# Altium project STEPPER-Board-v1.0.PrjPcb (part 5 of 7)

## Sheet Stepper_Driver_Sheet1.SchDoc
size 420 x 297 mm; SheetNumber: 7; SheetTotal: 14
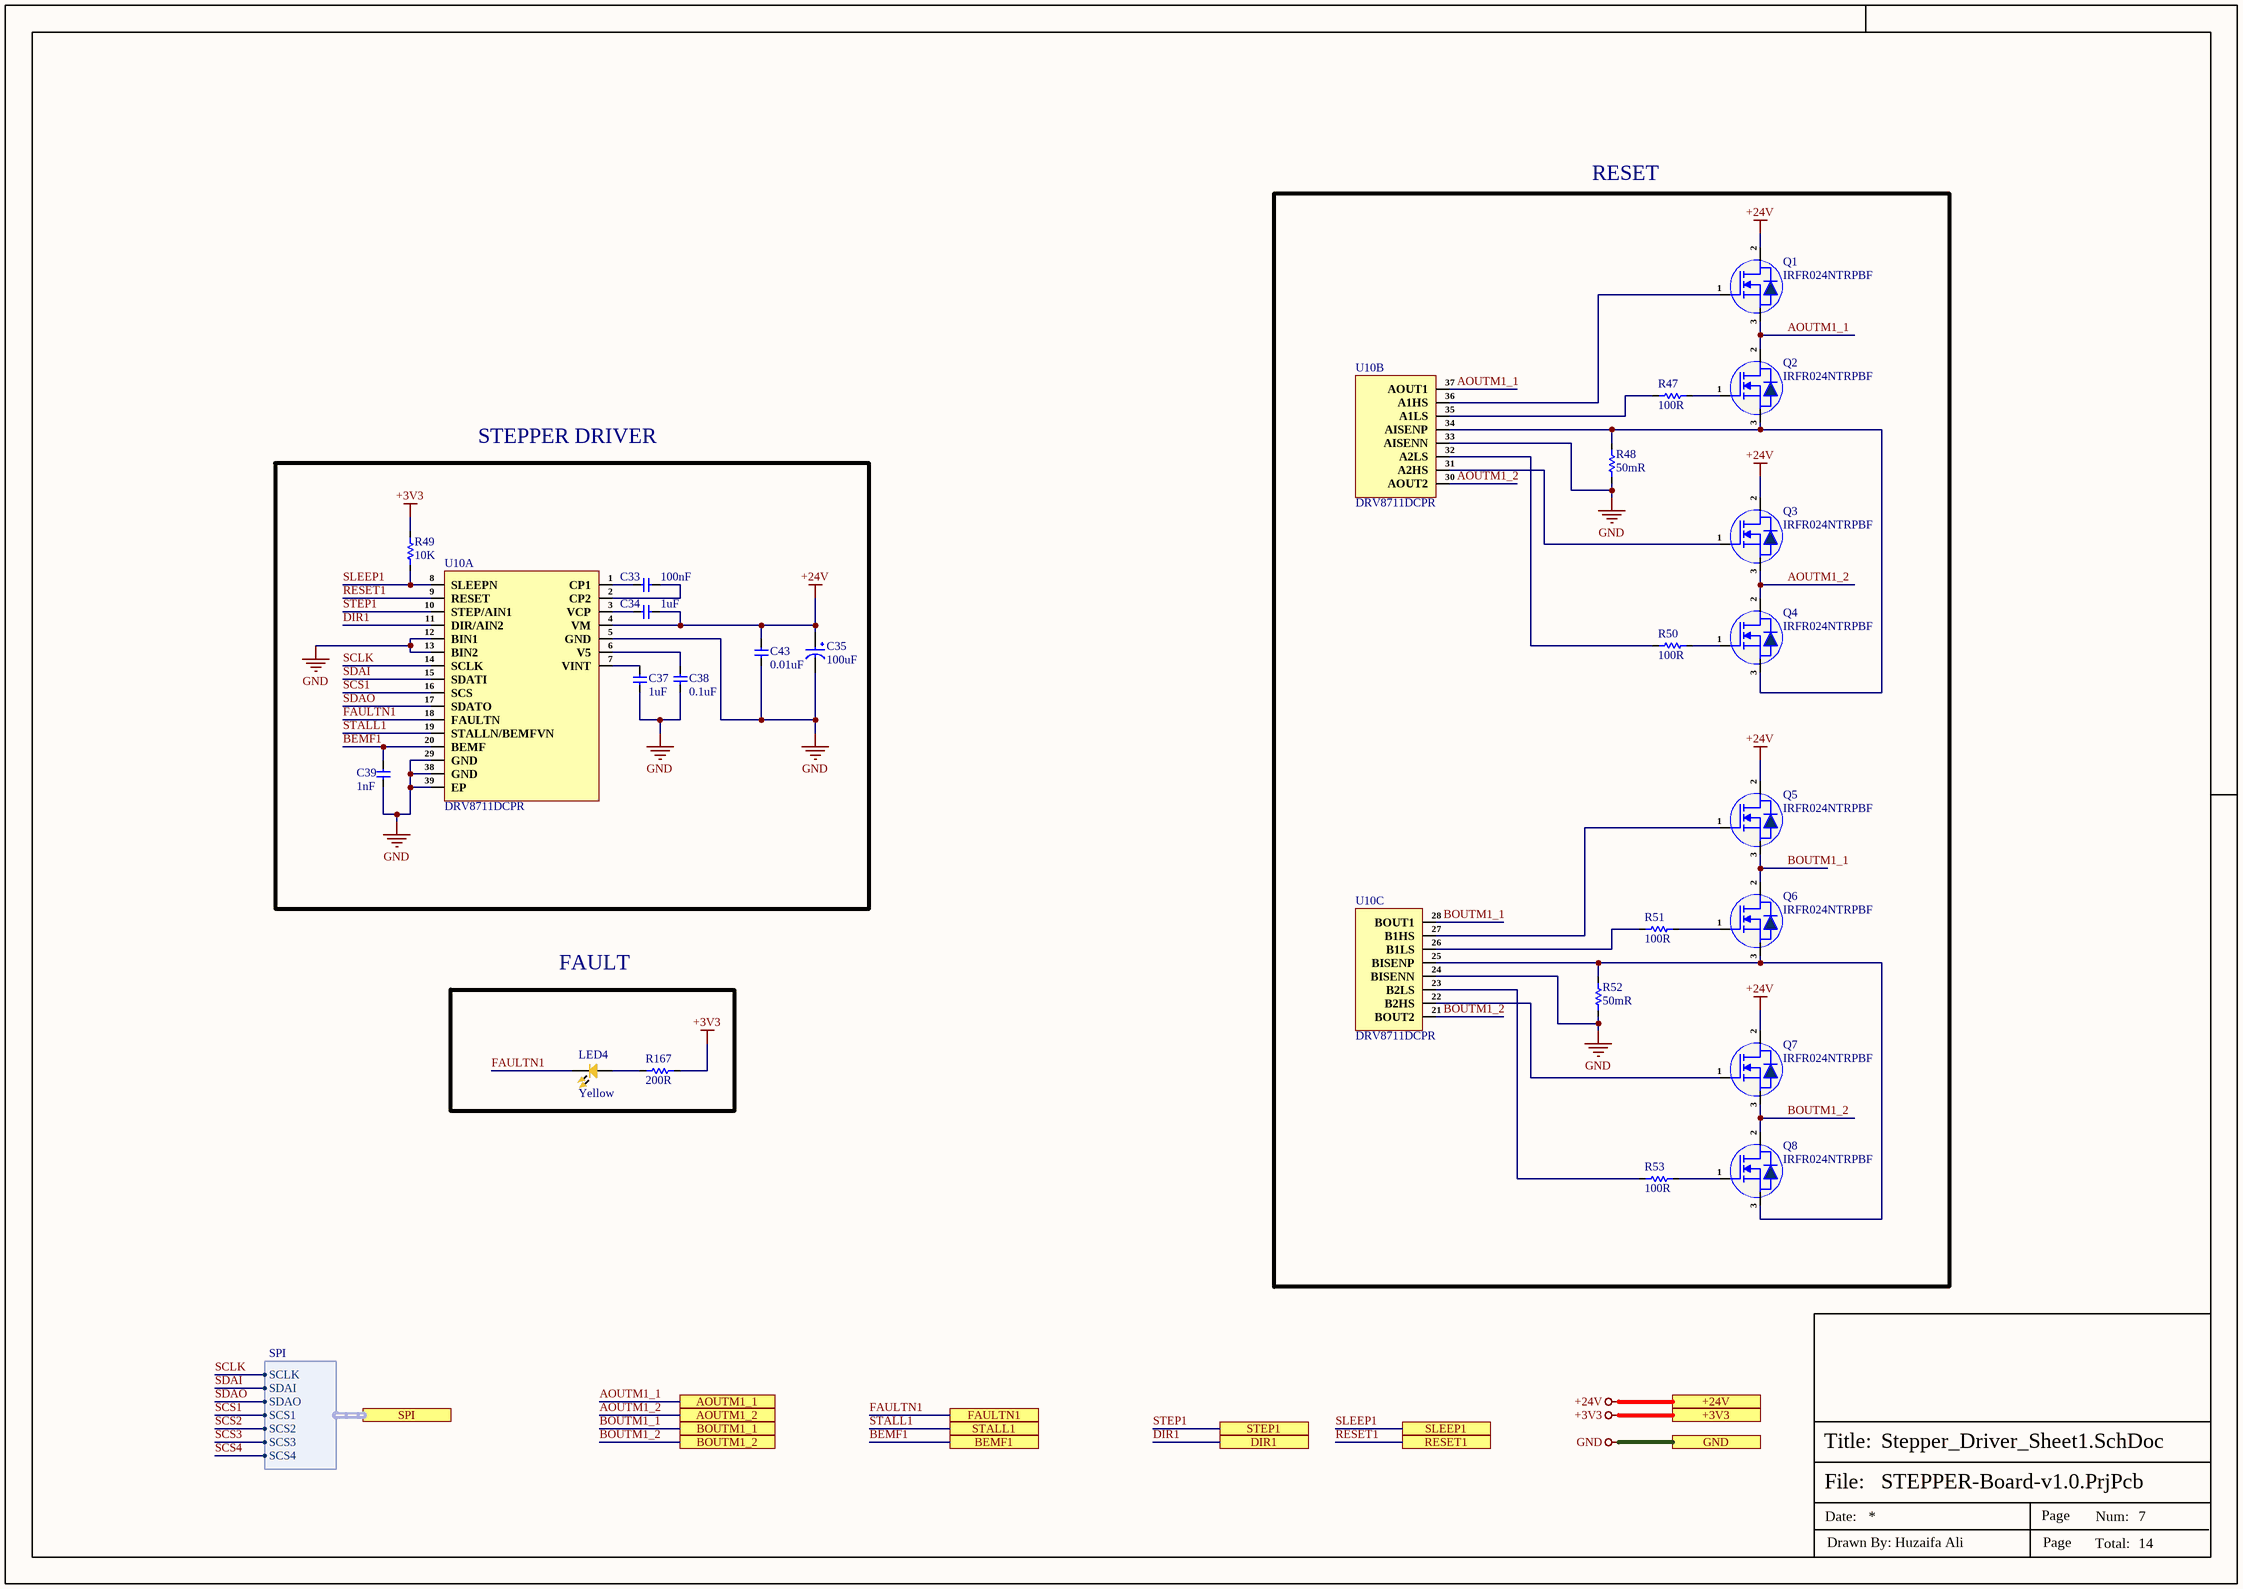
[diagram p9: Stepper_Driver_Sheet1.SchDoc]

### Parts
C33  100nF  [cap-0402]
C34  1uF  [Cap-0402]
C35  100uF  [UWT1H101MNL1GS_]
C37  1uF  [Cap-0402]
C38  0.1uF  [Cap-0402]
C39  1nF  [Cap-0402]
C43  0.01uF  [Cap-0603]
LED4  Yellow  [LED-0603]
Q1  IRFR024NTRPBF  [DPAK]
Q2  IRFR024NTRPBF  [DPAK]
Q3  IRFR024NTRPBF  [DPAK]
Q4  IRFR024NTRPBF  [DPAK]
Q5  IRFR024NTRPBF  [DPAK]
Q6  IRFR024NTRPBF  [DPAK]
Q7  IRFR024NTRPBF  [DPAK]
Q8  IRFR024NTRPBF  [DPAK]
R47  100R  [Res-0402]
R48  50mR  [RES-2010]
R49  10K  [Res-0402]
R50  100R  [Res-0402]
R51  100R  [Res-0402]
R52  50mR  [RES-2010]
R53  100R  [Res-0402]
R167  200R  [Res-0402]
U10  DRV8711DCPR  [HTSSOP-38-EP-4.4mm]  (parts A,B,C of 3)

### Blocks framed on the sheet
RESET: Q1-Q8 R47 R48 R50-R53 U10
STEPPER DRIVER: C33-C35 C37-C39 C43 R49 U10
FAULT: LED4 R167

### Ports
+3V3 (see Top_Sheet[4A], CAN_Sheet[5D], Controller_Sheet[5D], EtherCAT_Sheet[5D], GPIO_EXPANDER_Sheet[5D], Power_Sheet[5D], RJ45_Sheet[5D], RS485_RS232_Sheet[2D], Stepper_Driver_Sheet2[5D], Stepper_Driver_Sheet3[5D], Stepper_Driver_Sheet4[5D]), +24V (see Top_Sheet[4A], Connector_Sheet[5D], Power_Sheet[5D], Stepper_Driver_Sheet2[5D], Stepper_Driver_Sheet3[5D], Stepper_Driver_Sheet4[5D]), AOUTM1_1 (see Top_Sheet[5A], Connector_Sheet[1D]), AOUTM1_2 (see Top_Sheet[5A], Connector_Sheet[1D]), BEMF1 (see Top_Sheet[4A], Controller_Sheet[4D]), BOUTM1_1 (see Top_Sheet[5B], Connector_Sheet[1D]), BOUTM1_2 (see Top_Sheet[5B], Connector_Sheet[1D]), DIR1 (see Top_Sheet[4A], Controller_Sheet[4D]), FAULTN1 (see Top_Sheet[4A], GPIO_EXPANDER_Sheet[2D]), GND (see Top_Sheet[4A], CAN_Sheet[5D], Connector_Sheet[5D], Controller_Sheet[5D], DIO_Isolation_Sheet[5D], EtherCAT_Sheet[5D], GPIO_EXPANDER_Sheet[5D], Power_Sheet[5D], RJ45_Sheet[5D], RS485_RS232_Sheet[2D], Stepper_Driver_Sheet2[5D], Stepper_Driver_Sheet3[5D], Stepper_Driver_Sheet4[5D]), RESET1 (see Top_Sheet[4A], GPIO_EXPANDER_Sheet[3D]), SLEEP1 (see Top_Sheet[4B], GPIO_EXPANDER_Sheet[3D]), SPI (harness SPI, see Top_Sheet[5A], Controller_Sheet[1D], GPIO_EXPANDER_Sheet[1D], Stepper_Driver_Sheet2[1D], Stepper_Driver_Sheet3[1D], Stepper_Driver_Sheet4[1D]), STALL1 (see Top_Sheet[4A], GPIO_EXPANDER_Sheet[2D]), STEP1 (see Top_Sheet[4A], Controller_Sheet[4D])

### Harnesses
SPI: SCLK, SDAI, SDAO, SCS1, SCS2, SCS3, SCS4

### Nets
+3V3: R49.1 R167.2 ; port +3V3
+24V: C34.2 C35.1 C43.2 Q1.2(D) Q3.2(D) Q5.2(D) Q7.2(D) U10.4(VM) ; port +24V
GND: C35.2 C37.1 C38.2 C39.1 C43.1 R48.1 R52.1 U10.5(GND) U10.12(BIN1) U10.13(BIN2) U10.24(BISENN) U10.29(GND) U10.33(AISENN) U10.38(GND) U10.39(EP) ; port GND
AOUTM1_1: Q1.3(S) Q2.2(D) U10.37(AOUT1) ; port AOUTM1_1
AOUTM1_2: Q3.3(S) Q4.2(D) U10.30(AOUT2) ; port AOUTM1_2
BEMF1: C39.2 U10.20(BEMF) ; port BEMF1
BOUTM1_1: Q5.3(S) Q6.2(D) U10.28(BOUT1) ; port BOUTM1_1
BOUTM1_2: Q7.3(S) Q8.2(D) U10.21(BOUT2) ; port BOUTM1_2
DIR1: U10.11(DIR/AIN2) ; port DIR1
FAULTN1: LED4.2 U10.18(FAULTN) ; port FAULTN1
RESET1: U10.9(RESET) ; port RESET1
SCLK: U10.14(SCLK) ; port SPI.SCLK
SCS1: U10.16(SCS) ; port SPI.SCS1
SDAI: U10.15(SDATI) ; port SPI.SDAI
SDAO: U10.17(SDATO) ; port SPI.SDAO
SLEEP1: R49.2 U10.8(SLEEPN) ; port SLEEP1
STALL1: U10.19(STALLN/BEMFVN) ; port STALL1
STEP1: U10.10(STEP/AIN1) ; port STEP1
NetC33_1: C33.1 U10.1(CP1)
NetC33_2: C33.2 U10.2(CP2)
NetC34_1: C34.1 U10.3(VCP)
NetC37_2: C37.2 U10.7(VINT)
NetC38_1: C38.1 U10.6(V5)
NetLED4_1: LED4.1 R167.1
NetQ1_1: Q1.1(G) U10.36(A1HS)
NetQ2_1: Q2.1(G) R47.2
NetQ2_3: Q2.3(S) Q4.3(S) R48.2 U10.34(AISENP)
NetQ3_1: Q3.1(G) U10.31(A2HS)
NetQ4_1: Q4.1(G) R50.2
NetQ5_1: Q5.1(G) U10.27(B1HS)
NetQ6_1: Q6.1(G) R51.2
NetQ6_3: Q6.3(S) Q8.3(S) R52.2 U10.25(BISENP)
NetQ7_1: Q7.1(G) U10.22(B2HS)
NetQ8_1: Q8.1(G) R53.2
NetR47_1: R47.1 U10.35(A1LS)
NetR50_1: R50.1 U10.32(A2LS)
NetR51_1: R51.1 U10.26(B1LS)
NetR53_1: R53.1 U10.23(B2LS)

### Notes on the sheet
- File:
- Title:
- Date:
- Page
- Num:
- Total:
- Drawn By: Huzaifa Ali

### Library data of the parts
C33 = C1005X7R1H104KT000F: CAP CER 0.1UF 50V X7R 0402; Manufacturer: TDK; Tolerance: 10%; Voltage: 25V; Item Type: Capacitor; Supplier 1: Avnet; Manufacturer Part Number: C1005X7R1H104KT000F; RoHS: No; Category: Ceramic Capacitors; Dielectric: X7R; Supplier Part Number 1: C1005X7R1H104KT000F; LCSC Part Number: C361198; ComponentLink1Description: LCSC; ComponentLink1URL: https://www.lcsc.com/product-detail/Multilayer-Ceramic-Capacitors-MLCC-SMD-SMT_TDK-C1005X7R1H104KT000F_C361198.html
C34 C37 = CC0402KRX5R6BB105: CAP CER 1UF 10V X5R 0402; Manufacturer: Yageo; Tolerance: 10%; Dissipation Factor: 15%; Item Type: Capacitor; Supplier 1: Mouser; Manufacturer Part Number: CC0402KRX5R6BB105; RoHS: Yes; Category: Ceramic Capacitors; Stock 1: 6711367; Pricing 1: 1=0.11000, 10=0.05500, 50=0.05500, 100=0.03300, 500=0.02700, 1000=0.02200, 2500=0.02100, 10000=0.01800 (USD); Mount: Surface Mount; Case/Package: 0402; Number of Pins: 2; Case Code (Metric): 1005; Case Code (Imperial): 0402; Min Operating Temperature: -55°C; Max Operating Temperature: 85°C; Capacitance: 1uF; Dielectric: X5R; Package Quantity: 1; Voltage Rating: 10V; Packaging: Tape and Reel; Voltage Rating (DC): 10V; Termination: SMD/SMT; Resistor Type: Ceramic; Series: CC; Construction: Flat; Length: 1mm; Width: 0.02inch; Height: 0.5mm; Thickness: 0.022inch; Depth: 0.5mm; Radiation Hardening: No; REACH SVHC: No SVHC; Lead Free: Lead Free; Halogen Free: Halogen Free; RoHS Compliant: Yes; ComponentLink1URL: https://datasheet.ciiva.com/176/upy-gphc-x5r-4v-to-50v-12-176704.pdf?src-supplier=Digi-Key; ComponentLink1Description: https://datasheet.ciiva.com/176/upy-gphc-x5r-4v-to-50v-12-176704.pdf?src-supplier=Digi-Key; ComponentLink2URL: https://datasheet.ciiva.com/176/mlccorderingcode-176705.pdf?src-supplier=Digi-Key; ComponentLink2Description: https://datasheet.ciiva.com/176/mlccorderingcode-176705.pdf?src-supplier=Digi-Key; ComponentLink3URL: https://datasheet.ciiva.com/176/mlccorderingcode-176706.pdf?src-supplier=Digi-Key; ComponentLink3Description: https://datasheet.ciiva.com/176/mlccorderingcode-176706.pdf?src-supplier=Digi-Key; Supplier Part Number 1: 603-CC402KRX5R6BB105; LCSC Part Number: C106254
C35 = UWT1H101MNL1GS: CAP ALUM 100UF 20% 50V SMD; Manufacturer: Nichicon; Dielectric Material: Aluminium; Ripple Current: 140mA; Leakage Current: 3uA; Life (Hours): 1000Hour; Dissipation Factor: 0.14%; Item Type: Capacitor; Supplier 1: Digi-Key; Manufacturer Part Number: UWT1H101MNL1GS; Stock 1: 24169; Pricing 1: 1=0.57, 10=0.405, 50=0.3058, 100=0.2664 (USD); Mount: Surface Mount; Case/Package: Radial; Number of Pins: 2; Min Operating Temperature: -55°C; Max Operating Temperature: 105°C; Capacitance: 100uF; Tolerance: 20%; Package Quantity: 500; Voltage Rating: 50V; Packaging: Tape and Reel; Ripple Current (AC): 140mA; Voltage Rating (DC): 50V; Termination: SMD/SMT; Voltage: 50V; Series: WT; Construction: Cylindrical; Diameter: 8mm; Length: 10mm; Height: 10mm; Height - Seated (Max): 0.413inch; Radiation Hardening: No; REACH SVHC: No SVHC; Lead Free: Lead Free; RoHS Compliant: Yes; ComponentLink1URL: http://www.farnell.com/datasheets/2100058.pdf?src-supplier=Element14; ComponentLink1Description: http://www.farnell.com/datasheets/2100058.pdf?src-supplier=Element14; ComponentLink2URL: http://www.farnell.com/datasheets/2576809.pdf?src-supplier=Element14; ComponentLink2Description: http://www.farnell.com/datasheets/2576809.pdf?src-supplier=Element14; ComponentLink3URL: http://www.nichicon.co.jp/english/products/pdfs/e-ch_ref.pdf?src-supplier=Digi-Key; ComponentLink3Description: http://www.nichicon.co.jp/english/products/pdfs/e-ch_ref.pdf?src-supplier=Digi-Key; ComponentLink4URL: http://www.mouser.com/ds/2/293/e-wt-30307.pdf?src-supplier=Mouser; ComponentLink4Description: http://www.mouser.com/ds/2/293/e-wt-30307.pdf?src-supplier=Mouser; ComponentLink5URL: http://uk.rs-online.com/webdocs/13ec/0900766b813ecfdc.pdf?src-supplier=RSComponents; ComponentLink5Description: http://uk.rs-online.com/webdocs/13ec/0900766b813ecfdc.pdf?src-supplier=RSComponents; ComponentLink6URL: http://www.nichicon.co.jp/english/products/pdfs/e-wt.pdf?src-supplier=Avnet; ComponentLink6Description: http://www.nichicon.co.jp/english/products/pdfs/e-wt.pdf?src-supplier=Avnet; ComponentLink7URL: http://products.nichicon.co.jp/en/pdf/XJA043/e-wt.pdf?src-supplier=Future+Electronics; ComponentLink7Description: http://products.nichicon.co.jp/en/pdf/XJA043/e-wt.pdf?src-supplier=Future+Electronics; ComponentLink8URL: http://www.nichicon.co.jp/english/products/pdfs/e-wt.pdf?src-supplier=Avnet+Europe; ComponentLink8Description: http://www.nichicon.co.jp/english/products/pdfs/e-wt.pdf?src-supplier=Avnet+Europe; Supplier Part Number 1: 493-2226-1-ND; LCSC Part Number: C445063
C38 = CC0402JRX7R7BB104: CAP CER 0.1UF 16V X7R 0402; Manufacturer: Yageo; Material: 4241ConductorMaterial; Value: 100nF; Tolerance: 5%; Item Type: Capacitor; Supplier: Digikey; Supplier Part Number: 311-1676-1-ND; Manufacturer Part Number: CC0402JRX7R7BB104; RoHS: Yes; Category: Ceramic Capacitors; Stock: 1659111; Pricing: 1=0.1, 10=0.046, 50=0.0262, 100=0.0203, 500=0.01528, 1000=0.012, 2500=0.01091, 5000=0.01004 (USD); Mounting Technology: Surface Mount; Case/Package: 0402; Case Code (Metric): 1005; Case Code (Imperial): 0402; Min Operating Temperature: -55°C; Max Operating Temperature: 125°C; Dielectric: X7R; Packaging: Tape and Reel; Package Quantity: 10000; Voltage Rating (DC): 16V; Voltage Rating: 16V; Series: CC; Construction: Flat; Length: 0.039inch; Width: 0.02inch; Height: 0.5mm; Thickness: 0.022inch; Lead Free: Lead Free; Halogen Free: Halogen Free; RoHS Compliant: Yes; ComponentLink1URL: https://datasheet.ciiva.com/13210/upy-gphc-x7r-6-3v-to-50v-8-12304-13210152.pdf?src-supplier=Mouser; ComponentLink1Description: https://datasheet.ciiva.com/13210/upy-gphc-x7r-6-3v-to-50v-8-12304-13210152.pdf?src-supplier=Mouser; LCSC Part Number: C541464
C39 = C1005C0G1E102JT000F: CAP CER 1000PF 25V C0G 0402; Manufacturer: TDK; Item Type: Capacitor; ComponentLink1Description: LCSC; ComponentLink1URL: https://www.lcsc.com/product-detail/Multilayer-Ceramic-Capacitors-MLCC-SMD-SMT_TDK-C1005C0G1E102JT000F_C343059.html; Manufacturer Part Number: C1005C0G1E102JT000F; Package: 0402; LCSC Part Number: C343059
C43 = GRM1885C1H103JA01D: CAP CER 10000PF 50V C0G/NP0 0603; Manufacturer: Murata; Material: Ceramic; Capacitance: 10nF; Tolerance: 5%; Dielectric: C0G; Supplier 1: RSComponents; Manufacturer Part Number: GRM1885C1H103JA01D; RoHS: Yes; Category: Ceramic Capacitors; Stock 1: 80000; Pricing 1: 4000=0.03500, 8000=0.03200 (GBP); Mount: Surface Mount; Case/Package: 0603; Case Code (Metric): 1608; Case Code (Imperial): 0603; Min Operating Temperature: -55°C; Max Operating Temperature: 125°C; Packaging: Tape and Reel; Package Quantity: 4000; Voltage Rating: 50V; Voltage Rating (DC): 50V; Termination: SMD/SMT; Voltage: 50V; Series: GRM; Length: 1.6mm; Width: 0.8mm; Height: 0.8mm; Thickness: 0.035inch; Lead Pitch: 0.5mm; Depth: 0.8mm; REACH SVHC: No SVHC; Lead Free: Lead Free; RoHS Compliant: Yes; ComponentLink1URL: https://datasheet.ciiva.com/41860/partnumbering-e-01-41860759.pdf?src-supplier=Digi-Key; ComponentLink1Description: https://datasheet.ciiva.com/41860/partnumbering-e-01-41860759.pdf?src-supplier=Digi-Key; ComponentLink2URL: https://datasheet.ciiva.com/29537/partnumbering-e-01-29537910.pdf?src-supplier=Digi-Key; ComponentLink2Description: https://datasheet.ciiva.com/29537/partnumbering-e-01-29537910.pdf?src-supplier=Digi-Key; Supplier Part Number 1: 1449032
LED4 = NCD0603Y2: yellow 0603 Light Emitting Diodes (LED) ROHS; Manufacturer: Foshan NationStar Optoelectronics; Manufacturer Part Number: NCD0603Y2; Package: 0603; LCSC Part Number: C89811; Item Type: LED; ComponentLink1Description: LCSC; ComponentLink1URL: https://www.lcsc.com/product-detail/Light-Emitting-Diodes-LED_Foshan-NationStar-Optoelectronics-NCD0603Y2_C89811.html
Q1-Q8 = IRFR024NTRPBF: MOSFET N-CH 55V 17A DPAK; Manufacturer: Infineon; Nominal Vgs: 4V; Number of Elements: 1NUMBER; Fall Time: 27ns; Element Configuration: 5460ElementConfiguration; On-State Resistance: 75mR; Value: 75mR; Supplier: Mouser; Supplier Part Number: 942-IRFR024NTRPBF; Manufacturer Part Number: IRFR024NTRPBF; RoHS: Yes; Item Type: MOSFET; Stock: 51400; Pricing: 1=0.62, 10=0.541, 50=0.541, 100=0.375, 1000=0.294, 10000=0.293 (USD); Current Rating: 17A; Voltage Rating (DC): 55V; Package Quantity: 2000NUMBER; Radiation Hardening: 5898YesNo
R47 R50 R51 R53 = RC0402FR-07100RL: RES 100 OHM 1% 1/16W 0402; Manufacturer: Yageo; Power Rating: 62.5mW; Voltage Rating: 50V; Temperature Coefficient: 100ppm/°C; Max Power Dissipation: 63mW; Item Type: Resistor; Supplier 1: Mouser; Manufacturer Part Number: RC0402FR-07100RL; RoHS: Yes; Category: Chip SMD Resistors; Stock 1: 699545; Pricing 1: 1=0.10000, 10=0.01200, 50=0.01200, 100=0.00500, 1000=0.00300, 2500=0.00200, 10000=0.00100 (USD); Case/Package: 0402; Number of Pins: 2; Case Code (Imperial): 0402; Case Code (Metric): 1005; Size Code: 0402; Min Operating Temperature: -55°C; Max Operating Temperature: 155°C; Tolerance: 1%; Voltage Rating (DC): 50V; Resistance: 100R; Packaging: Tape and Reel; Termination: SMD/SMT; Resistor Type: Thick Film; Features: Moisture Resistant; Series: RC; Number of Terminations: 2; Resistance Tolerance: 1%; Construction: Rectangular; Technology: THICK FILM; Length: 1mm; Width: 0.5mm; Height: 0.32mm; Depth: 0.5mm; RoHS Compliant: Yes; REACH SVHC: No SVHC; Military Standard: Not; Lead Free: Lead Free; ComponentLink1URL: https://datasheet.ciiva.com/11808/0900766b80c66297-11808765.pdf?src-supplier=RSComponents; ComponentLink1Description: https://datasheet.ciiva.com/11808/0900766b80c66297-11808765.pdf?src-supplier=RSComponents; ComponentLink2URL: https://datasheet.ciiva.com/7849/1784430-7849810.pdf?src-supplier=Element14; ComponentLink2Description: https://datasheet.ciiva.com/7849/1784430-7849810.pdf?src-supplier=Element14; ComponentLink3URL: https://datasheet.ciiva.com/28367/1018594-28367226.pdf?src-supplier=Element14; ComponentLink3Description: https://datasheet.ciiva.com/28367/1018594-28367226.pdf?src-supplier=Element14; ComponentLink4URL: https://datasheet.ciiva.com/22747/1018594-22747511.pdf?src-supplier=Element14; ComponentLink4Description: https://datasheet.ciiva.com/22747/1018594-22747511.pdf?src-supplier=Element14; ComponentLink5URL: https://datasheet.ciiva.com/12667/pyu-rc0402-51-rohs-l-6-r-12667957.pdf?src-supplier=Mouser; ComponentLink5Description: https://datasheet.ciiva.com/12667/pyu-rc0402-51-rohs-l-6-r-12667957.pdf?src-supplier=Mouser; ComponentLink6URL: https://datasheet.ciiva.com/15189/getdatasheetpartid-329466-15189335.pdf?src-supplier=Verical; ComponentLink6Description: https://datasheet.ciiva.com/15189/getdatasheetpartid-329466-15189335.pdf?src-supplier=Verical; ComponentLink7URL: https://datasheet.ciiva.com/16740/pyu-rc0402-51-rohs-l-6-r-16740566.pdf?src-supplier=Future+Electronics; ComponentLink7Description: https://datasheet.ciiva.com/16740/pyu-rc0402-51-rohs-l-6-r-16740566.pdf?src-supplier=Future+Electronics; Supplier Part Number 1: 603-RC0402FR-07100RL; LCSC Part Number: C106232
R48 R52 = RLM20FECR050: 1W 50mΩ Surface Mount Current Sensing Resistors ±50ppm/℃ ±1% 2010 Current Sense Resistors/Shunt Resistors ROHS; Manufacturer: TA-I Tech; Manufacturer Part Number: RLM20FECR050; Package: 2010; LCSC Part Number: C912938; Item Type: Shunt Resistor; ComponentLink1Description: LCSC; ComponentLink1URL: https://www.lcsc.com/product-detail/Current-Sense-Resistors-Shunt-Resistors_TA-I-Tech-RLM20FECR050_C912938.html
R49 = RC0402FR-0710KL: RES 10K OHM 1% 1/16W 0402; Manufacturer: Yageo; Resistance: 10kR; Voltage Rating (DC): 50V; Temperature Coefficient: 100ppm/°C; Power Rating: 62.5mW; Max Power Dissipation: 63mW; Item Type: Resistor; Supplier 1: Mouser; Manufacturer Part Number: RC0402FR-0710KL; RoHS: Yes; Category: Chip SMD Resistors; Stock 1: 18648329; Pricing 1: 1=0.10000, 10=0.01400, 50=0.01400, 100=0.00500, 1000=0.00300, 10000=0.00200 (USD); Case/Package: 0402; Number of Pins: 2; Case Code (Imperial): 0402; Case Code (Metric): 1005; Min Operating Temperature: -55°C; Max Operating Temperature: 155°C; Resistor Type: Thick Film; Tolerance: 1%; Packaging: Tape and Reel; Voltage Rating: 50V; Termination: SMD/SMT; Working Voltage: 50V; Number of Terminations: 2; Features: Moisture Resistant; Series: RC; Resistance Tolerance: 1%; Construction: Rectangular; Length: 1mm; Width: 0.5mm; Height: 0.32mm; Depth: 0.5mm; Lead Pitch: 0.2mm; REACH SVHC: No SVHC; Lead Free: Lead Free; RoHS Compliant: Yes; Military Standard: Not; ComponentLink1URL: https://datasheet.ciiva.com/7660/38568-7660787.pdf?src-supplier=Element14; ComponentLink1Description: https://datasheet.ciiva.com/7660/38568-7660787.pdf?src-supplier=Element14; ComponentLink2URL: https://datasheet.ciiva.com/7849/1686128-7849814.pdf?src-supplier=Element14; ComponentLink2Description: https://datasheet.ciiva.com/7849/1686128-7849814.pdf?src-supplier=Element14; ComponentLink3URL: https://datasheet.ciiva.com/7983/1018594-7983486.pdf?src-supplier=Element14; ComponentLink3Description: https://datasheet.ciiva.com/7983/1018594-7983486.pdf?src-supplier=Element14; ComponentLink4URL: https://datasheet.ciiva.com/22747/1018594-22747512.pdf?src-supplier=Element14; ComponentLink4Description: https://datasheet.ciiva.com/22747/1018594-22747512.pdf?src-supplier=Element14; ComponentLink5URL: https://datasheet.ciiva.com/12667/pyu-rc0402-51-rohs-l-6-r-12667067.pdf?src-supplier=Mouser; ComponentLink5Description: https://datasheet.ciiva.com/12667/pyu-rc0402-51-rohs-l-6-r-12667067.pdf?src-supplier=Mouser; ComponentLink6URL: https://datasheet.ciiva.com/7849/1784430-7849813.pdf?src-supplier=Element14; ComponentLink6Description: https://datasheet.ciiva.com/7849/1784430-7849813.pdf?src-supplier=Element14; ComponentLink7URL: https://datasheet.ciiva.com/7849/1784430-7849815.pdf?src-supplier=Element14; ComponentLink7Description: https://datasheet.ciiva.com/7849/1784430-7849815.pdf?src-supplier=Element14; Supplier Part Number 1: 603-RC0402FR-0710KL; LCSC Part Number: C60490
R167 = RC0402FR-07200RL: RES 200 OHM 1% 1/16W 0402; Manufacturer: Yageo; Temperature Coefficient: 100ppm/°C; Power Rating: 63mW; Voltage Rating (DC): 50V; Supplier 1: Digi-Key; Manufacturer Part Number: RC0402FR-07200RL; RoHS: Yes; Category: Chip SMD Resistors; Stock 1: 19778; Pricing 1: 1=0.10000, 10=0.01600, 100=0.00660, 1000=0.00299, 2500=0.00259, 5000=0.00214 (USD); Case/Package: 0402; Case Code (Metric): 1005; Case Code (Imperial): 0402; Size Code: 0402; Min Operating Temperature: -55°C; Max Operating Temperature: 155°C; Tolerance: 1%; Resistance: 200R; Resistor Type: Thick Film; Packaging: Tape and Reel; Voltage Rating: 50V; Package Quantity: 1; Number of Terminations: 2; Termination: SMD/SMT; Max Power Dissipation: 63mW; Features: Moisture Resistant; Series: RC; Construction: Rectangular; Resistance Tolerance: 1%; Length: 1mm; Width: 0.02inch; Height: 0.016inch; Depth: 0.5mm; REACH SVHC: No SVHC; Lead Free: Lead Free; RoHS Compliant: Yes; Military Standard: Not; ComponentLink1URL: https://datasheet.ciiva.com/2553/pyu-r-int-thick-7-2553232.pdf?src-supplier=Digi-Key; ComponentLink1Description: https://datasheet.ciiva.com/2553/pyu-r-int-thick-7-2553232.pdf?src-supplier=Digi-Key; ComponentLink2URL: https://datasheet.ciiva.com/7983/1018594-7983509.pdf?src-supplier=Element14; ComponentLink2Description: https://datasheet.ciiva.com/7983/1018594-7983509.pdf?src-supplier=Element14; ComponentLink3URL: https://datasheet.ciiva.com/16804/pyu-rc0402-51-rohs-l-6-r-16804406.pdf?src-supplier=Future+Electronics; ComponentLink3Description: https://datasheet.ciiva.com/16804/pyu-rc0402-51-rohs-l-6-r-16804406.pdf?src-supplier=Future+Electronics; ComponentLink4URL: https://datasheet.ciiva.com/15189/getdatasheetpartid-331152-15189383.pdf?src-supplier=Verical; ComponentLink4Description: https://datasheet.ciiva.com/15189/getdatasheetpartid-331152-15189383.pdf?src-supplier=Verical; ComponentLink5URL: https://datasheet.ciiva.com/7849/1018594-7849898.pdf?src-supplier=Element14; ComponentLink5Description: https://datasheet.ciiva.com/7849/1018594-7849898.pdf?src-supplier=Element14; ComponentLink6URL: https://datasheet.ciiva.com/5562/pyu-rc0402-51-rohs-l-6-r-8721-5562539.pdf?src-supplier=Mouser; ComponentLink6Description: https://datasheet.ciiva.com/5562/pyu-rc0402-51-rohs-l-6-r-8721-5562539.pdf?src-supplier=Mouser; ComponentLink7URL: https://datasheet.ciiva.com/7849/1018594-7849899.pdf?src-supplier=Element14; ComponentLink7Description: https://datasheet.ciiva.com/7849/1018594-7849899.pdf?src-supplier=Element14; ComponentLink8URL: https://datasheet.ciiva.com/2553/pyu-r-int-thick-7-2553230.pdf?src-supplier=Digi-Key; ComponentLink8Description: https://datasheet.ciiva.com/2553/pyu-r-int-thick-7-2553230.pdf?src-supplier=Digi-Key; ComponentLink9URL: https://datasheet.ciiva.com/2553/pyu-r-int-thick-7-2553231.pdf?src-supplier=Digi-Key; ComponentLink9Description: https://datasheet.ciiva.com/2553/pyu-r-int-thick-7-2553231.pdf?src-supplier=Digi-Key; Supplier Part Number 1: 311-200LRCT-ND; LCSC Part Number: C114764
U10 = DRV8711DCPR: IC MTR DRV BIPOLR 8-52V 38HTSSOP; Manufacturer: Texas Instruments; Output Current: 200mA; Output Voltage: 5V; Min Supply Voltage: 8V; Max Supply Voltage: 52V; Interface: SPI; Supply Current: 17mA; Supplier: Mouser; LCSC Part Number: C60013; Manufacturer Part Number: DRV8711DCPR; RoHS: Yes; Item Type: IC; Stock: 9050; Pricing: 1=4.97, 10=4.29, 50=4.29, 100=3.66, 1000=2.63, 10000=2.48 (USD); Mounting Technology: Surface Mount; Case/Package: HTSSOP; Pins: 38; Min Operating Temperature: -40°C; Max Operating Temperature: 85°C; Packaging: Tape and Reel; Package Quantity: 2000; Series: -; Radiation Hardening: No; Lead Free: Lead Free; RoHS Compliant: Yes; ComponentLink1URL: https://datasheet.ciiva.com/24016/slvsc40d-317294-24016712.pdf?src-supplier=Mouser; ComponentLink1Description: https://datasheet.ciiva.com/24016/slvsc40d-317294-24016712.pdf?src-supplier=Mouser

## Sheet Stepper_Driver_Sheet2.SchDoc
size 420 x 297 mm; SheetNumber: 8; SheetTotal: 14
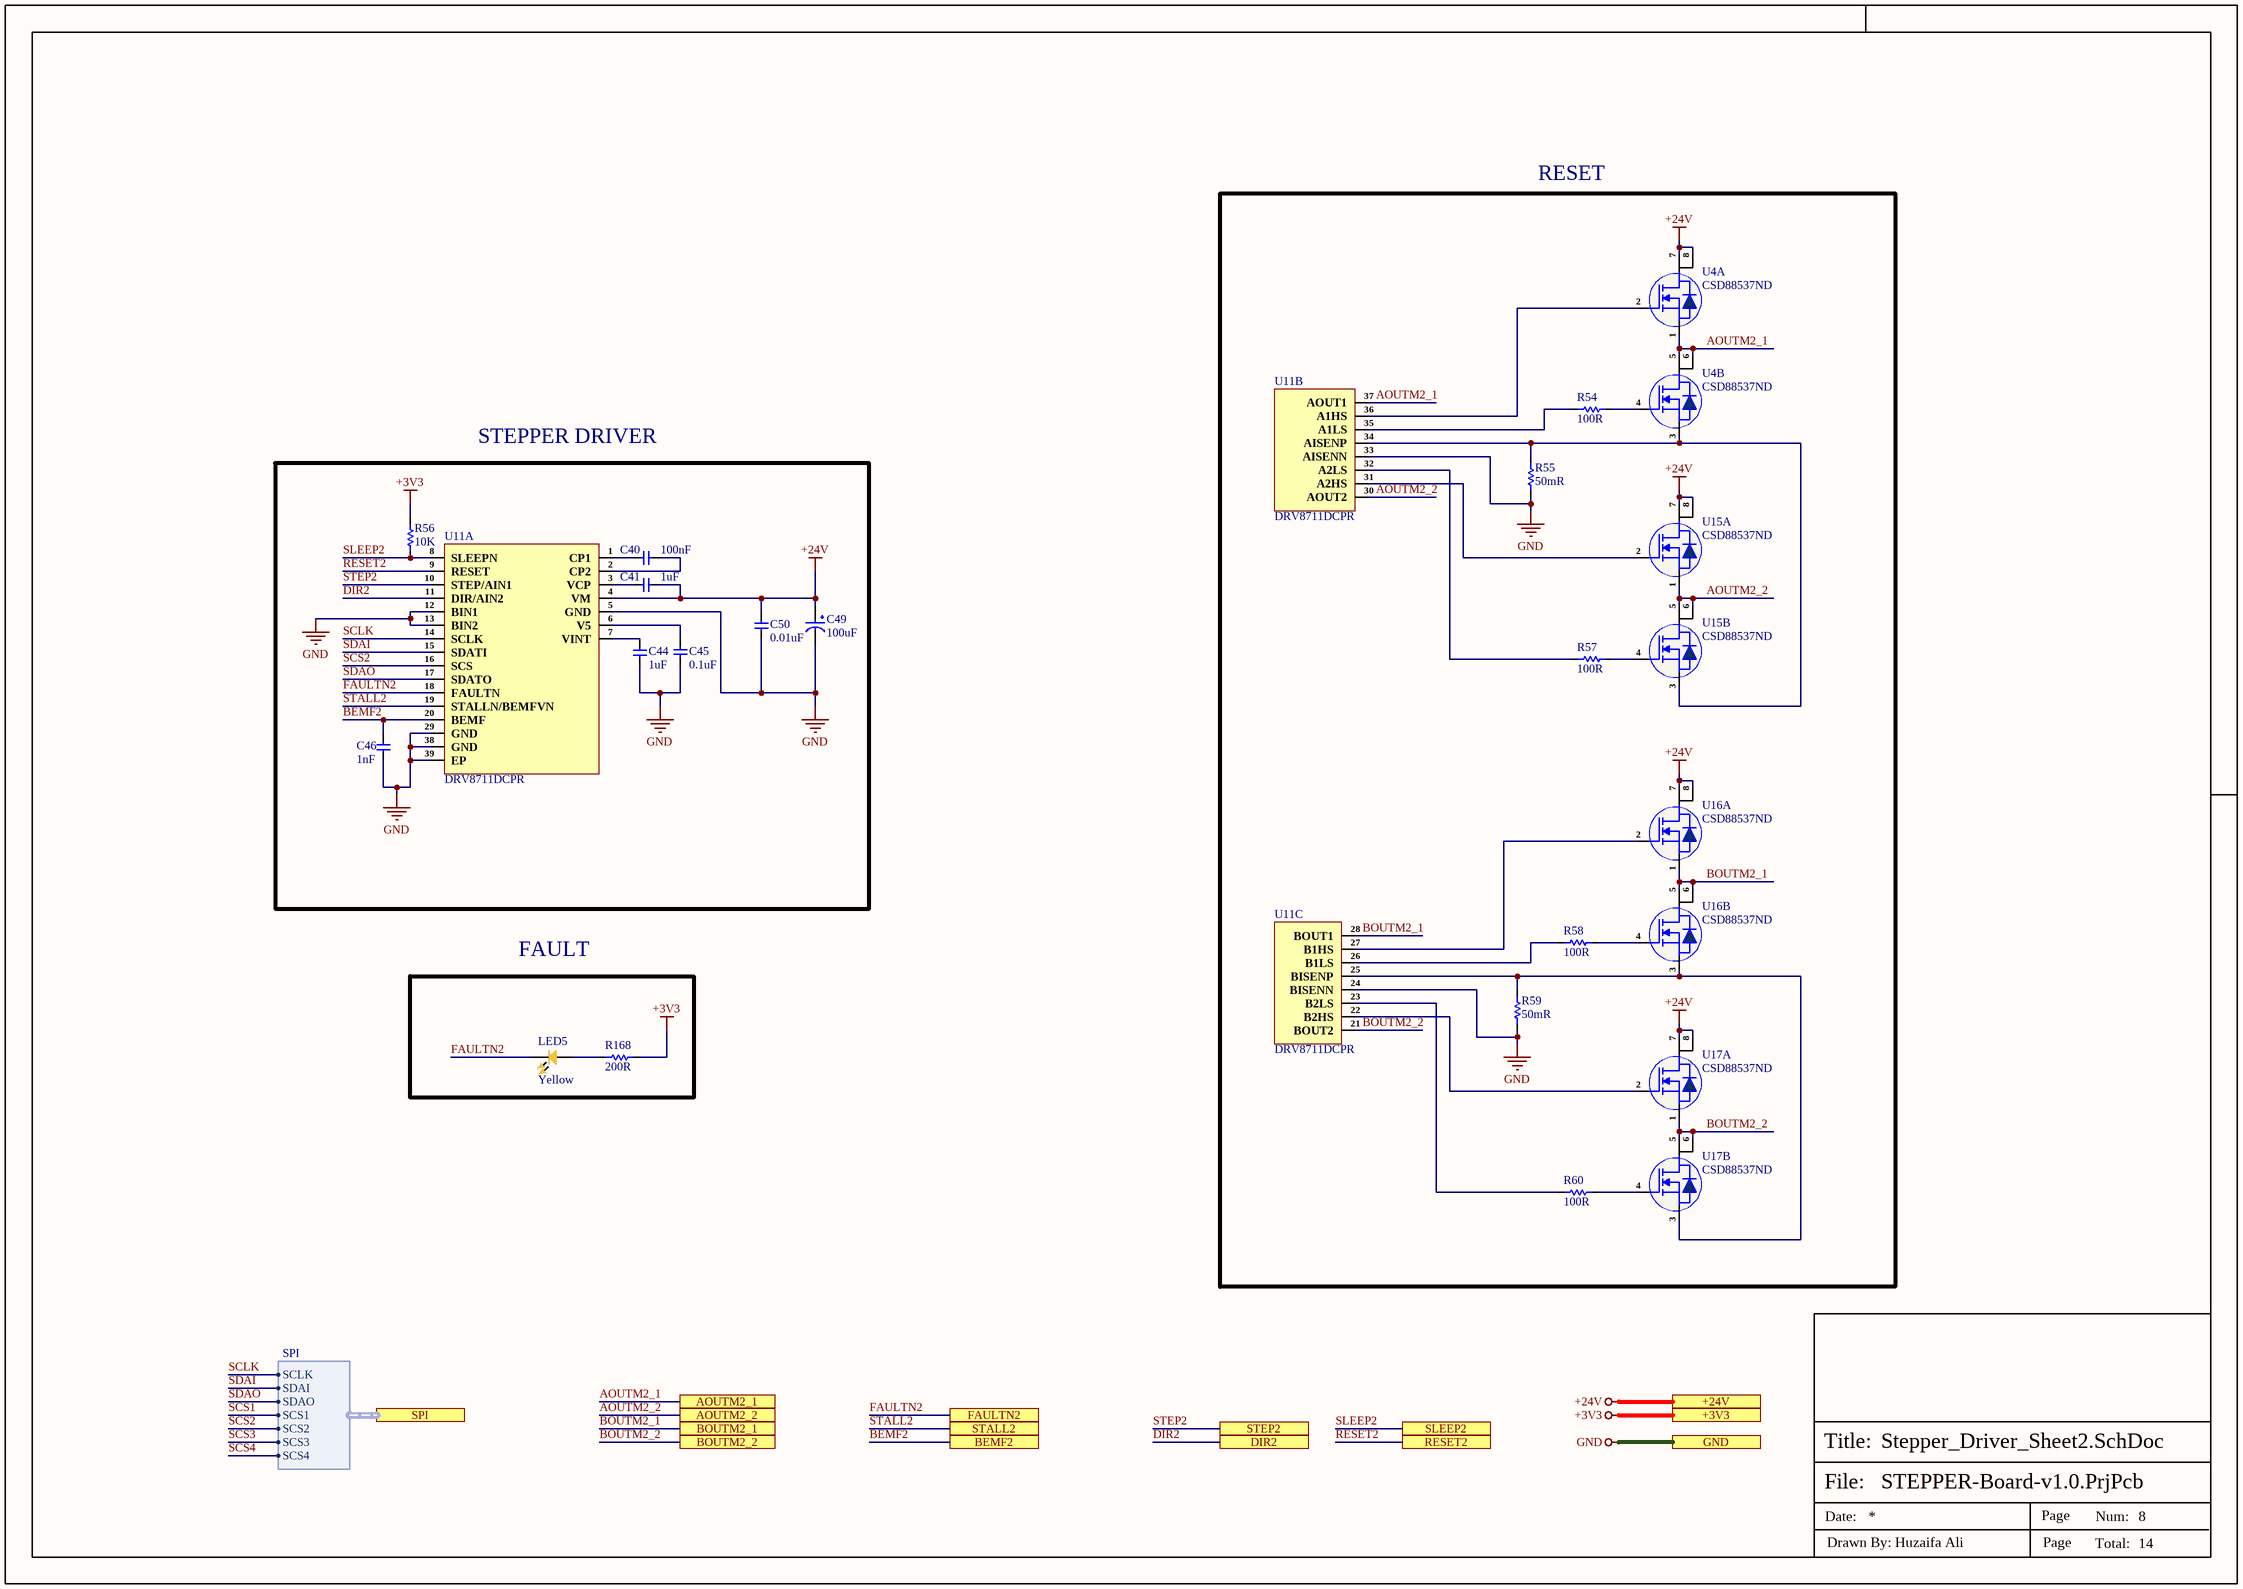
[diagram p10: Stepper_Driver_Sheet2.SchDoc]

### Parts
C40  100nF  [cap-0402]
C41  1uF  [Cap-0402]
C44  1uF  [Cap-0402]
C45  0.1uF  [Cap-0402]
C46  1nF  [Cap-0402]
C49  100uF  [UWT1H101MNL1GS_]
C50  0.01uF  [Cap-0603]
LED5  Yellow  [LED-0603]
R54  100R  [Res-0402]
R55  50mR  [RES-2010]
R56  10K  [Res-0402]
R57  100R  [Res-0402]
R58  100R  [Res-0402]
R59  50mR  [RES-2010]
R60  100R  [Res-0402]
R168  200R  [Res-0402]
U4  CSD88537ND  [SOIC-8]  (parts A,B of 2)
U11  DRV8711DCPR  [HTSSOP-38-EP-4.4mm]  (parts A,B,C of 3)
U15  CSD88537ND  [SOIC-8]  (parts A,B of 2)
U16  CSD88537ND  [SOIC-8]  (parts A,B of 2)
U17  CSD88537ND  [SOIC-8]  (parts A,B of 2)

### Blocks framed on the sheet
RESET: R54 R55 R57-R60 U4 U11 U15-U17
STEPPER DRIVER: C40 C41 C44-C46 C49 C50 R56 U11
FAULT: LED5 R168

### Ports
+3V3 (see Top_Sheet[6A], CAN_Sheet[5D], Controller_Sheet[5D], EtherCAT_Sheet[5D], GPIO_EXPANDER_Sheet[5D], Power_Sheet[5D], RJ45_Sheet[5D], RS485_RS232_Sheet[2D], Stepper_Driver_Sheet1[5D], Stepper_Driver_Sheet3[5D], Stepper_Driver_Sheet4[5D]), +24V (see Top_Sheet[6A], Connector_Sheet[5D], Power_Sheet[5D], Stepper_Driver_Sheet1[5D], Stepper_Driver_Sheet3[5D], Stepper_Driver_Sheet4[5D]), AOUTM2_1 (see Top_Sheet[6A], Connector_Sheet[1D]), AOUTM2_2 (see Top_Sheet[6A], Connector_Sheet[1D]), BEMF2 (see Top_Sheet[6A], Controller_Sheet[4D]), BOUTM2_1 (see Top_Sheet[6B], Connector_Sheet[1D]), BOUTM2_2 (see Top_Sheet[6B], Connector_Sheet[1D]), DIR2 (see Top_Sheet[6A], Controller_Sheet[4D]), FAULTN2 (see Top_Sheet[6A], GPIO_EXPANDER_Sheet[2D]), GND (see Top_Sheet[6A], CAN_Sheet[5D], Connector_Sheet[5D], Controller_Sheet[5D], DIO_Isolation_Sheet[5D], EtherCAT_Sheet[5D], GPIO_EXPANDER_Sheet[5D], Power_Sheet[5D], RJ45_Sheet[5D], RS485_RS232_Sheet[2D], Stepper_Driver_Sheet1[5D], Stepper_Driver_Sheet3[5D], Stepper_Driver_Sheet4[5D]), RESET2 (see Top_Sheet[6A], GPIO_EXPANDER_Sheet[3D]), SLEEP2 (see Top_Sheet[6B], GPIO_EXPANDER_Sheet[3D]), SPI (harness SPI, see Top_Sheet[6A], Controller_Sheet[1D], GPIO_EXPANDER_Sheet[1D], Stepper_Driver_Sheet1[1D], Stepper_Driver_Sheet3[1D], Stepper_Driver_Sheet4[1D]), STALL2 (see Top_Sheet[6A], GPIO_EXPANDER_Sheet[2D]), STEP2 (see Top_Sheet[6A], Controller_Sheet[4D])

### Harnesses
SPI: SCLK, SDAI, SDAO, SCS1, SCS2, SCS3, SCS4

### Nets
+3V3: R56.1 R168.2 ; port +3V3
+24V: C41.2 C49.1 C50.2 U4.7(D1) U4.8(D1) U11.4(VM) U15.7(D1) U15.8(D1) U16.7(D1) U16.8(D1) U17.7(D1) U17.8(D1) ; port +24V
GND: C44.1 C45.2 C46.1 C49.2 C50.1 R55.1 R59.1 U11.5(GND) U11.12(BIN1) U11.13(BIN2) U11.24(BISENN) U11.29(GND) U11.33(AISENN) U11.38(GND) U11.39(EP) ; port GND
AOUTM2_1: U4.1(S1) U4.5(D2) U4.6(D2) U11.37(AOUT1) ; port AOUTM2_1
AOUTM2_2: U11.30(AOUT2) U15.1(S1) U15.5(D2) U15.6(D2) ; port AOUTM2_2
BEMF2: C46.2 U11.20(BEMF) ; port BEMF2
BOUTM2_1: U11.28(BOUT1) U16.1(S1) U16.5(D2) U16.6(D2) ; port BOUTM2_1
BOUTM2_2: U11.21(BOUT2) U17.1(S1) U17.5(D2) U17.6(D2) ; port BOUTM2_2
DIR2: U11.11(DIR/AIN2) ; port DIR2
FAULTN2: LED5.2 U11.18(FAULTN) ; port FAULTN2
RESET2: U11.9(RESET) ; port RESET2
SCLK: U11.14(SCLK) ; port SPI.SCLK
SCS2: U11.16(SCS) ; port SPI.SCS2
SDAI: U11.15(SDATI) ; port SPI.SDAI
SDAO: U11.17(SDATO) ; port SPI.SDAO
SLEEP2: R56.2 U11.8(SLEEPN) ; port SLEEP2
STALL2: U11.19(STALLN/BEMFVN) ; port STALL2
STEP2: U11.10(STEP/AIN1) ; port STEP2
NetC40_1: C40.1 U11.1(CP1)
NetC40_2: C40.2 U11.2(CP2)
NetC41_1: C41.1 U11.3(VCP)
NetC44_2: C44.2 U11.7(VINT)
NetC45_1: C45.1 U11.6(V5)
NetLED5_1: LED5.1 R168.1
NetR54_1: R54.1 U11.35(A1LS)
NetR54_2: R54.2 U4.4(G4)
NetR55_2: R55.2 U4.3(S2) U11.34(AISENP) U15.3(S2)
NetR57_1: R57.1 U11.32(A2LS)
NetR57_2: R57.2 U15.4(G4)
NetR58_1: R58.1 U11.26(B1LS)
NetR58_2: R58.2 U16.4(G4)
NetR59_2: R59.2 U11.25(BISENP) U16.3(S2) U17.3(S2)
NetR60_1: R60.1 U11.23(B2LS)
NetR60_2: R60.2 U17.4(G4)
NetU4_2: U4.2(G1) U11.36(A1HS)
NetU11_22: U11.22(B2HS) U17.2(G1)
NetU11_27: U11.27(B1HS) U16.2(G1)
NetU11_31: U11.31(A2HS) U15.2(G1)

### Notes on the sheet
- File:
- Title:
- Date:
- Page
- Num:
- Total:
- Drawn By: Huzaifa Ali

### Library data of the parts
C40 = C1005X7R1H104KT000F: as C33 on sheet Stepper_Driver_Sheet1; Supplier 1: Avnet; Manufacturer Part Number: C1005X7R1H104KT000F; RoHS: No; Category: Ceramic Capacitors; Dielectric: X7R; Supplier Part Number 1: C1005X7R1H104KT000F; LCSC Part Number: C361198; ComponentLink1Description: LCSC; ComponentLink1URL: https://www.lcsc.com/product-detail/Multilayer-Ceramic-Capacitors-MLCC-SMD-SMT_TDK-C1005X7R1H104KT000F_C361198.html
C41 C44 = CC0402KRX5R6BB105: as C34 on sheet Stepper_Driver_Sheet1; Supplier 1: Mouser; Manufacturer Part Number: CC0402KRX5R6BB105; RoHS: Yes; Category: Ceramic Capacitors; Stock 1: 6711367; Pricing 1: 1=0.11000, 10=0.05500, 50=0.05500, 100=0.03300, 500=0.02700, 1000=0.02200, 2500=0.02100, 10000=0.01800 (USD); Mount: Surface Mount; Case/Package: 0402; Number of Pins: 2; Case Code (Metric): 1005; Case Code (Imperial): 0402; Min Operating Temperature: -55°C; Max Operating Temperature: 85°C; Capacitance: 1uF; Dielectric: X5R; Package Quantity: 1; Voltage Rating: 10V; Packaging: Tape and Reel; Voltage Rating (DC): 10V; Termination: SMD/SMT; Resistor Type: Ceramic; Series: CC; Construction: Flat; Length: 1mm; Width: 0.02inch; Height: 0.5mm; Thickness: 0.022inch; Depth: 0.5mm; Radiation Hardening: No; REACH SVHC: No SVHC; Lead Free: Lead Free; Halogen Free: Halogen Free; RoHS Compliant: Yes; ComponentLink1URL: https://datasheet.ciiva.com/176/upy-gphc-x5r-4v-to-50v-12-176704.pdf?src-supplier=Digi-Key; ComponentLink1Description: https://datasheet.ciiva.com/176/upy-gphc-x5r-4v-to-50v-12-176704.pdf?src-supplier=Digi-Key; ComponentLink2URL: https://datasheet.ciiva.com/176/mlccorderingcode-176705.pdf?src-supplier=Digi-Key; ComponentLink2Description: https://datasheet.ciiva.com/176/mlccorderingcode-176705.pdf?src-supplier=Digi-Key; ComponentLink3URL: https://datasheet.ciiva.com/176/mlccorderingcode-176706.pdf?src-supplier=Digi-Key; ComponentLink3Description: https://datasheet.ciiva.com/176/mlccorderingcode-176706.pdf?src-supplier=Digi-Key; Supplier Part Number 1: 603-CC402KRX5R6BB105; LCSC Part Number: C106254
C45 = CC0402JRX7R7BB104: as C38 on sheet Stepper_Driver_Sheet1; Supplier: Digikey; Supplier Part Number: 311-1676-1-ND; Manufacturer Part Number: CC0402JRX7R7BB104; RoHS: Yes; Category: Ceramic Capacitors; Stock: 1659111; Pricing: 1=0.1, 10=0.046, 50=0.0262, 100=0.0203, 500=0.01528, 1000=0.012, 2500=0.01091, 5000=0.01004 (USD); Mounting Technology: Surface Mount; Case/Package: 0402; Case Code (Metric): 1005; Case Code (Imperial): 0402; Min Operating Temperature: -55°C; Max Operating Temperature: 125°C; Dielectric: X7R; Packaging: Tape and Reel; Package Quantity: 10000; Voltage Rating (DC): 16V; Voltage Rating: 16V; Series: CC; Construction: Flat; Length: 0.039inch; Width: 0.02inch; Height: 0.5mm; Thickness: 0.022inch; Lead Free: Lead Free; Halogen Free: Halogen Free; RoHS Compliant: Yes; ComponentLink1URL: https://datasheet.ciiva.com/13210/upy-gphc-x7r-6-3v-to-50v-8-12304-13210152.pdf?src-supplier=Mouser; ComponentLink1Description: https://datasheet.ciiva.com/13210/upy-gphc-x7r-6-3v-to-50v-8-12304-13210152.pdf?src-supplier=Mouser; LCSC Part Number: C541464
C46 = C1005C0G1E102JT000F: as C39 on sheet Stepper_Driver_Sheet1; ComponentLink1Description: LCSC; ComponentLink1URL: https://www.lcsc.com/product-detail/Multilayer-Ceramic-Capacitors-MLCC-SMD-SMT_TDK-C1005C0G1E102JT000F_C343059.html; Manufacturer Part Number: C1005C0G1E102JT000F; Package: 0402; LCSC Part Number: C343059
C49 = UWT1H101MNL1GS: as C35 on sheet Stepper_Driver_Sheet1; Supplier 1: Digi-Key; Manufacturer Part Number: UWT1H101MNL1GS; Stock 1: 24169; Pricing 1: 1=0.57, 10=0.405, 50=0.3058, 100=0.2664 (USD); Mount: Surface Mount; Case/Package: Radial; Number of Pins: 2; Min Operating Temperature: -55°C; Max Operating Temperature: 105°C; Capacitance: 100uF; Tolerance: 20%; Package Quantity: 500; Voltage Rating: 50V; Packaging: Tape and Reel; Ripple Current (AC): 140mA; Voltage Rating (DC): 50V; Termination: SMD/SMT; Voltage: 50V; Series: WT; Construction: Cylindrical; Diameter: 8mm; Length: 10mm; Height: 10mm; Height - Seated (Max): 0.413inch; Radiation Hardening: No; REACH SVHC: No SVHC; Lead Free: Lead Free; RoHS Compliant: Yes; ComponentLink1URL: http://www.farnell.com/datasheets/2100058.pdf?src-supplier=Element14; ComponentLink1Description: http://www.farnell.com/datasheets/2100058.pdf?src-supplier=Element14; ComponentLink2URL: http://www.farnell.com/datasheets/2576809.pdf?src-supplier=Element14; ComponentLink2Description: http://www.farnell.com/datasheets/2576809.pdf?src-supplier=Element14; ComponentLink3URL: http://www.nichicon.co.jp/english/products/pdfs/e-ch_ref.pdf?src-supplier=Digi-Key; ComponentLink3Description: http://www.nichicon.co.jp/english/products/pdfs/e-ch_ref.pdf?src-supplier=Digi-Key; ComponentLink4URL: http://www.mouser.com/ds/2/293/e-wt-30307.pdf?src-supplier=Mouser; ComponentLink4Description: http://www.mouser.com/ds/2/293/e-wt-30307.pdf?src-supplier=Mouser; ComponentLink5URL: http://uk.rs-online.com/webdocs/13ec/0900766b813ecfdc.pdf?src-supplier=RSComponents; ComponentLink5Description: http://uk.rs-online.com/webdocs/13ec/0900766b813ecfdc.pdf?src-supplier=RSComponents; ComponentLink6URL: http://www.nichicon.co.jp/english/products/pdfs/e-wt.pdf?src-supplier=Avnet; ComponentLink6Description: http://www.nichicon.co.jp/english/products/pdfs/e-wt.pdf?src-supplier=Avnet; ComponentLink7URL: http://products.nichicon.co.jp/en/pdf/XJA043/e-wt.pdf?src-supplier=Future+Electronics; ComponentLink7Description: http://products.nichicon.co.jp/en/pdf/XJA043/e-wt.pdf?src-supplier=Future+Electronics; ComponentLink8URL: http://www.nichicon.co.jp/english/products/pdfs/e-wt.pdf?src-supplier=Avnet+Europe; ComponentLink8Description: http://www.nichicon.co.jp/english/products/pdfs/e-wt.pdf?src-supplier=Avnet+Europe; Supplier Part Number 1: 493-2226-1-ND; LCSC Part Number: C445063
C50 = GRM1885C1H103JA01D: as C43 on sheet Stepper_Driver_Sheet1; Supplier 1: RSComponents; Manufacturer Part Number: GRM1885C1H103JA01D; RoHS: Yes; Category: Ceramic Capacitors; Stock 1: 80000; Pricing 1: 4000=0.03500, 8000=0.03200 (GBP); Mount: Surface Mount; Case/Package: 0603; Case Code (Metric): 1608; Case Code (Imperial): 0603; Min Operating Temperature: -55°C; Max Operating Temperature: 125°C; Packaging: Tape and Reel; Package Quantity: 4000; Voltage Rating: 50V; Voltage Rating (DC): 50V; Termination: SMD/SMT; Voltage: 50V; Series: GRM; Length: 1.6mm; Width: 0.8mm; Height: 0.8mm; Thickness: 0.035inch; Lead Pitch: 0.5mm; Depth: 0.8mm; REACH SVHC: No SVHC; Lead Free: Lead Free; RoHS Compliant: Yes; ComponentLink1URL: https://datasheet.ciiva.com/41860/partnumbering-e-01-41860759.pdf?src-supplier=Digi-Key; ComponentLink1Description: https://datasheet.ciiva.com/41860/partnumbering-e-01-41860759.pdf?src-supplier=Digi-Key; ComponentLink2URL: https://datasheet.ciiva.com/29537/partnumbering-e-01-29537910.pdf?src-supplier=Digi-Key; ComponentLink2Description: https://datasheet.ciiva.com/29537/partnumbering-e-01-29537910.pdf?src-supplier=Digi-Key; Supplier Part Number 1: 1449032
LED5 = NCD0603Y2: as LED4 on sheet Stepper_Driver_Sheet1; Manufacturer Part Number: NCD0603Y2; Package: 0603; LCSC Part Number: C89811; Item Type: LED; ComponentLink1Description: LCSC; ComponentLink1URL: https://www.lcsc.com/product-detail/Light-Emitting-Diodes-LED_Foshan-NationStar-Optoelectronics-NCD0603Y2_C89811.html
R54 R57 R58 R60 = RC0402FR-07100RL: as R47 on sheet Stepper_Driver_Sheet1; Supplier 1: Mouser; Manufacturer Part Number: RC0402FR-07100RL; RoHS: Yes; Category: Chip SMD Resistors; Stock 1: 699545; Pricing 1: 1=0.10000, 10=0.01200, 50=0.01200, 100=0.00500, 1000=0.00300, 2500=0.00200, 10000=0.00100 (USD); Case/Package: 0402; Number of Pins: 2; Case Code (Imperial): 0402; Case Code (Metric): 1005; Size Code: 0402; Min Operating Temperature: -55°C; Max Operating Temperature: 155°C; Tolerance: 1%; Voltage Rating (DC): 50V; Resistance: 100R; Packaging: Tape and Reel; Termination: SMD/SMT; Resistor Type: Thick Film; Features: Moisture Resistant; Series: RC; Number of Terminations: 2; Resistance Tolerance: 1%; Construction: Rectangular; Technology: THICK FILM; Length: 1mm; Width: 0.5mm; Height: 0.32mm; Depth: 0.5mm; RoHS Compliant: Yes; REACH SVHC: No SVHC; Military Standard: Not; Lead Free: Lead Free; ComponentLink1URL: https://datasheet.ciiva.com/11808/0900766b80c66297-11808765.pdf?src-supplier=RSComponents; ComponentLink1Description: https://datasheet.ciiva.com/11808/0900766b80c66297-11808765.pdf?src-supplier=RSComponents; ComponentLink2URL: https://datasheet.ciiva.com/7849/1784430-7849810.pdf?src-supplier=Element14; ComponentLink2Description: https://datasheet.ciiva.com/7849/1784430-7849810.pdf?src-supplier=Element14; ComponentLink3URL: https://datasheet.ciiva.com/28367/1018594-28367226.pdf?src-supplier=Element14; ComponentLink3Description: https://datasheet.ciiva.com/28367/1018594-28367226.pdf?src-supplier=Element14; ComponentLink4URL: https://datasheet.ciiva.com/22747/1018594-22747511.pdf?src-supplier=Element14; ComponentLink4Description: https://datasheet.ciiva.com/22747/1018594-22747511.pdf?src-supplier=Element14; ComponentLink5URL: https://datasheet.ciiva.com/12667/pyu-rc0402-51-rohs-l-6-r-12667957.pdf?src-supplier=Mouser; ComponentLink5Description: https://datasheet.ciiva.com/12667/pyu-rc0402-51-rohs-l-6-r-12667957.pdf?src-supplier=Mouser; ComponentLink6URL: https://datasheet.ciiva.com/15189/getdatasheetpartid-329466-15189335.pdf?src-supplier=Verical; ComponentLink6Description: https://datasheet.ciiva.com/15189/getdatasheetpartid-329466-15189335.pdf?src-supplier=Verical; ComponentLink7URL: https://datasheet.ciiva.com/16740/pyu-rc0402-51-rohs-l-6-r-16740566.pdf?src-supplier=Future+Electronics; ComponentLink7Description: https://datasheet.ciiva.com/16740/pyu-rc0402-51-rohs-l-6-r-16740566.pdf?src-supplier=Future+Electronics; Supplier Part Number 1: 603-RC0402FR-07100RL; LCSC Part Number: C106232
R55 R59 = RLM20FECR050: as R48 on sheet Stepper_Driver_Sheet1; Manufacturer Part Number: RLM20FECR050; Package: 2010; LCSC Part Number: C912938; Item Type: Shunt Resistor; ComponentLink1Description: LCSC; ComponentLink1URL: https://www.lcsc.com/product-detail/Current-Sense-Resistors-Shunt-Resistors_TA-I-Tech-RLM20FECR050_C912938.html
R56 = RC0402FR-0710KL: as R49 on sheet Stepper_Driver_Sheet1; Supplier 1: Mouser; Manufacturer Part Number: RC0402FR-0710KL; RoHS: Yes; Category: Chip SMD Resistors; Stock 1: 18648329; Pricing 1: 1=0.10000, 10=0.01400, 50=0.01400, 100=0.00500, 1000=0.00300, 10000=0.00200 (USD); Case/Package: 0402; Number of Pins: 2; Case Code (Imperial): 0402; Case Code (Metric): 1005; Min Operating Temperature: -55°C; Max Operating Temperature: 155°C; Resistor Type: Thick Film; Tolerance: 1%; Packaging: Tape and Reel; Voltage Rating: 50V; Termination: SMD/SMT; Working Voltage: 50V; Number of Terminations: 2; Features: Moisture Resistant; Series: RC; Resistance Tolerance: 1%; Construction: Rectangular; Length: 1mm; Width: 0.5mm; Height: 0.32mm; Depth: 0.5mm; Lead Pitch: 0.2mm; REACH SVHC: No SVHC; Lead Free: Lead Free; RoHS Compliant: Yes; Military Standard: Not; ComponentLink1URL: https://datasheet.ciiva.com/7660/38568-7660787.pdf?src-supplier=Element14; ComponentLink1Description: https://datasheet.ciiva.com/7660/38568-7660787.pdf?src-supplier=Element14; ComponentLink2URL: https://datasheet.ciiva.com/7849/1686128-7849814.pdf?src-supplier=Element14; ComponentLink2Description: https://datasheet.ciiva.com/7849/1686128-7849814.pdf?src-supplier=Element14; ComponentLink3URL: https://datasheet.ciiva.com/7983/1018594-7983486.pdf?src-supplier=Element14; ComponentLink3Description: https://datasheet.ciiva.com/7983/1018594-7983486.pdf?src-supplier=Element14; ComponentLink4URL: https://datasheet.ciiva.com/22747/1018594-22747512.pdf?src-supplier=Element14; ComponentLink4Description: https://datasheet.ciiva.com/22747/1018594-22747512.pdf?src-supplier=Element14; ComponentLink5URL: https://datasheet.ciiva.com/12667/pyu-rc0402-51-rohs-l-6-r-12667067.pdf?src-supplier=Mouser; ComponentLink5Description: https://datasheet.ciiva.com/12667/pyu-rc0402-51-rohs-l-6-r-12667067.pdf?src-supplier=Mouser; ComponentLink6URL: https://datasheet.ciiva.com/7849/1784430-7849813.pdf?src-supplier=Element14; ComponentLink6Description: https://datasheet.ciiva.com/7849/1784430-7849813.pdf?src-supplier=Element14; ComponentLink7URL: https://datasheet.ciiva.com/7849/1784430-7849815.pdf?src-supplier=Element14; ComponentLink7Description: https://datasheet.ciiva.com/7849/1784430-7849815.pdf?src-supplier=Element14; Supplier Part Number 1: 603-RC0402FR-0710KL; LCSC Part Number: C60490
R168 = RC0402FR-07200RL: as R167 on sheet Stepper_Driver_Sheet1; Supplier 1: Digi-Key; Manufacturer Part Number: RC0402FR-07200RL; RoHS: Yes; Category: Chip SMD Resistors; Stock 1: 19778; Pricing 1: 1=0.10000, 10=0.01600, 100=0.00660, 1000=0.00299, 2500=0.00259, 5000=0.00214 (USD); Case/Package: 0402; Case Code (Metric): 1005; Case Code (Imperial): 0402; Size Code: 0402; Min Operating Temperature: -55°C; Max Operating Temperature: 155°C; Tolerance: 1%; Resistance: 200R; Resistor Type: Thick Film; Packaging: Tape and Reel; Voltage Rating: 50V; Package Quantity: 1; Number of Terminations: 2; Termination: SMD/SMT; Max Power Dissipation: 63mW; Features: Moisture Resistant; Series: RC; Construction: Rectangular; Resistance Tolerance: 1%; Length: 1mm; Width: 0.02inch; Height: 0.016inch; Depth: 0.5mm; REACH SVHC: No SVHC; Lead Free: Lead Free; RoHS Compliant: Yes; Military Standard: Not; ComponentLink1URL: https://datasheet.ciiva.com/2553/pyu-r-int-thick-7-2553232.pdf?src-supplier=Digi-Key; ComponentLink1Description: https://datasheet.ciiva.com/2553/pyu-r-int-thick-7-2553232.pdf?src-supplier=Digi-Key; ComponentLink2URL: https://datasheet.ciiva.com/7983/1018594-7983509.pdf?src-supplier=Element14; ComponentLink2Description: https://datasheet.ciiva.com/7983/1018594-7983509.pdf?src-supplier=Element14; ComponentLink3URL: https://datasheet.ciiva.com/16804/pyu-rc0402-51-rohs-l-6-r-16804406.pdf?src-supplier=Future+Electronics; ComponentLink3Description: https://datasheet.ciiva.com/16804/pyu-rc0402-51-rohs-l-6-r-16804406.pdf?src-supplier=Future+Electronics; ComponentLink4URL: https://datasheet.ciiva.com/15189/getdatasheetpartid-331152-15189383.pdf?src-supplier=Verical; ComponentLink4Description: https://datasheet.ciiva.com/15189/getdatasheetpartid-331152-15189383.pdf?src-supplier=Verical; ComponentLink5URL: https://datasheet.ciiva.com/7849/1018594-7849898.pdf?src-supplier=Element14; ComponentLink5Description: https://datasheet.ciiva.com/7849/1018594-7849898.pdf?src-supplier=Element14; ComponentLink6URL: https://datasheet.ciiva.com/5562/pyu-rc0402-51-rohs-l-6-r-8721-5562539.pdf?src-supplier=Mouser; ComponentLink6Description: https://datasheet.ciiva.com/5562/pyu-rc0402-51-rohs-l-6-r-8721-5562539.pdf?src-supplier=Mouser; ComponentLink7URL: https://datasheet.ciiva.com/7849/1018594-7849899.pdf?src-supplier=Element14; ComponentLink7Description: https://datasheet.ciiva.com/7849/1018594-7849899.pdf?src-supplier=Element14; ComponentLink8URL: https://datasheet.ciiva.com/2553/pyu-r-int-thick-7-2553230.pdf?src-supplier=Digi-Key; ComponentLink8Description: https://datasheet.ciiva.com/2553/pyu-r-int-thick-7-2553230.pdf?src-supplier=Digi-Key; ComponentLink9URL: https://datasheet.ciiva.com/2553/pyu-r-int-thick-7-2553231.pdf?src-supplier=Digi-Key; ComponentLink9Description: https://datasheet.ciiva.com/2553/pyu-r-int-thick-7-2553231.pdf?src-supplier=Digi-Key; Supplier Part Number 1: 311-200LRCT-ND; LCSC Part Number: C114764
U4 U15-U17 = CSD88537ND: MOSFET 2N-CH 60V 15A 8SOIC; Manufacturer: Texas Instruments; Item Type: IC; Supplier: Mouser; LCSC Part Number: C117439; Manufacturer Part Number: CSD88537ND; RoHS: Yes; Stock: 24825; Pricing: 1=1.26, 10=1.03, 50=1.03, 100=0.8, 1000=0.552, 10000=0.494 (USD); ComponentLink1URL: https://datasheet.ciiva.com/29589/csd88537nd-29589985.pdf?src-supplier=Digikey; ComponentLink1Description: https://datasheet.ciiva.com/29589/csd88537nd-29589985.pdf?src-supplier=Digikey; ComponentLink2URL: https://datasheet.ciiva.com/46430/1857624-46430364.pdf?src-supplier=Element14; ComponentLink2Description: https://datasheet.ciiva.com/46430/1857624-46430364.pdf?src-supplier=Element14
U11 = DRV8711DCPR: as U10 on sheet Stepper_Driver_Sheet1; Supplier: Mouser; LCSC Part Number: C60013; Manufacturer Part Number: DRV8711DCPR; RoHS: Yes; Item Type: IC; Stock: 9050; Pricing: 1=4.97, 10=4.29, 50=4.29, 100=3.66, 1000=2.63, 10000=2.48 (USD); Mounting Technology: Surface Mount; Case/Package: HTSSOP; Pins: 38; Min Operating Temperature: -40°C; Max Operating Temperature: 85°C; Packaging: Tape and Reel; Package Quantity: 2000; Series: -; Radiation Hardening: No; Lead Free: Lead Free; RoHS Compliant: Yes; ComponentLink1URL: https://datasheet.ciiva.com/24016/slvsc40d-317294-24016712.pdf?src-supplier=Mouser; ComponentLink1Description: https://datasheet.ciiva.com/24016/slvsc40d-317294-24016712.pdf?src-supplier=Mouser